# Altium schematic sheet PogoMiniSch.SchDoc
size A4
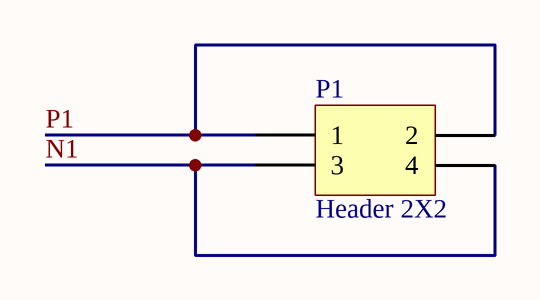
[diagram p0: PogoMiniSch.SchDoc]

## Parts
P1  Header 2X2  [HDR2X2]

## Nets
N1: P1.3 P1.4
P1: P1.1 P1.2

## Library data of the parts
P1 = Header 2X2: Header, 2-Pin, Dual row; LatestRevisionDate: 17-Jul-2002; LatestRevisionNote: Re-released for DXP Platform.; Publisher: Altium Limited